# EAGLE design Circuit (EAGLE 9.6.2)
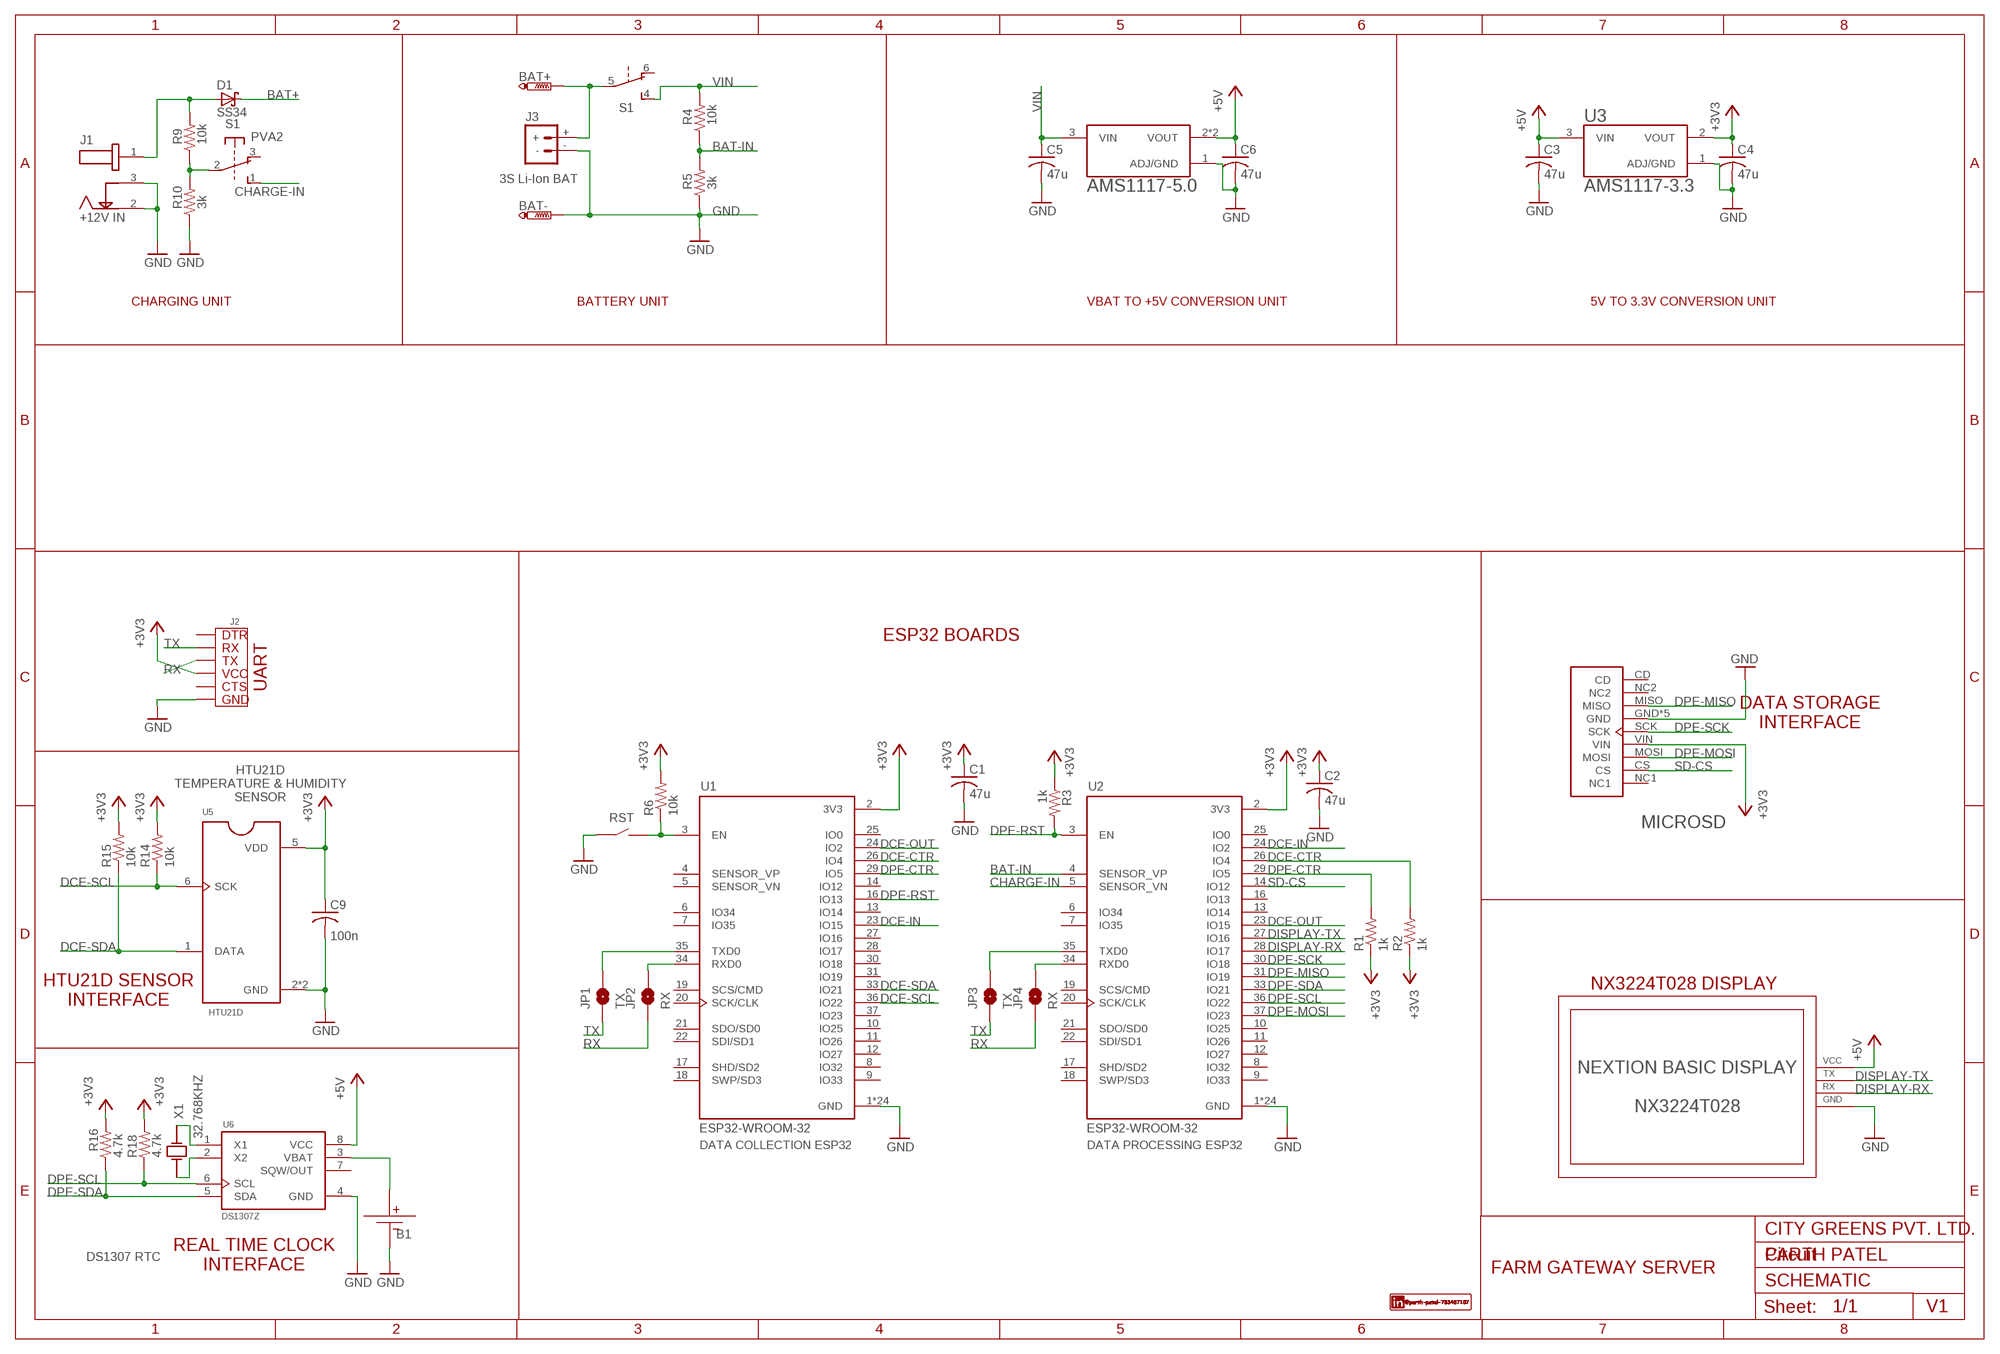
[diagram p0: schematic, sheet 1]

## Parts
B1  CR3032-METAL  [CR2032-METAL]
BAT+  PTR1TP20SQ  [TP20SQ]
BAT-  PTR1TP20SQ  [TP20SQ]
C1  47u  C-USC0805  [C0805]
C2  47u  C-USC0805  [C0805]
C3  47u  C-USC0805  [C0805]
C4  47u  C-USC0805  [C0805]
C5  47u  C-USC0805  [C0805]
C6  47u  C-USC0805  [C0805]
C9  100n  C-USC0805  [C0805]
D1  SS34  [DO214]
J1  +12V IN  DCJ200-10-A-XX-X_REVA  [GCT_DCJ200-10-A-XX-X_REVA]
J2  UART  [UART]
J3  3S Li-Ion BAT  BATTERY_CONN_DEANS  [DEANS]
JP1  TX  JUMPER-SMT_2_NO_NO-SILK  [SMT-JUMPER_2_NO_NO-SILK]
JP2  RX  JUMPER-SMT_2_NO_NO-SILK  [SMT-JUMPER_2_NO_NO-SILK]
JP3  TX  JUMPER-SMT_2_NO_NO-SILK  [SMT-JUMPER_2_NO_NO-SILK]
JP4  RX  JUMPER-SMT_2_NO_NO-SILK  [SMT-JUMPER_2_NO_NO-SILK]
MICROSD  ST-TF-003A  [SUNTECH_ST-TF-003A]
NX3224T028  NX3224T028_011  [NX3224T028_011]
R1  1k  R-US_R0805  [R0805]
R2  1k  R-US_R0805  [R0805]
R3  1k  R-US_R0805  [R0805]
R4  10k  R-US_R0805  [R0805]
R5  3k  R-US_R0805  [R0805]
R6  10k  R-US_R0805  [R0805]
R9  10k  R-US_R0805  [R0805]
R10  3k  R-US_R0805  [R0805]
R14  10k  R-US_R0805  [R0805]
R15  10k  R-US_R0805  [R0805]
R16  4.7k  R-US_R0805  [R0805]
R18  4.7k  R-US_R0805  [R0805]
RST  4.5X4.5-SMD-TACTILE-SWITCH  [SMD-4.5X4.5-TACTILE-PUSH-BUTTON]
S1  PVA2  [PVA2F]
U1  ESP32-WROOM-32  [MODULE_ESP32-WROOM-32]
U2  ESP32-WROOM-32  [MODULE_ESP32-WROOM-32]
U3  AMS1117-3.3  [SOT229P700X180-4N]
U4  AMS1117-5.0  [SOT229P700X180-4N]
U5  HTU21D  [QFN100P300X300X100-7N]
U6  DS1307Z  [SOIC127P600X175-8N]
X1  32.768KHZ  AB38T-32.768KHZ  [XTAL_AB38T-32.768KHZ]

## Nets
+3V3: C1.1 C2.1 C4.1 C9.1 J2.VCC MICROSD.VIN R1.1 R2.1 R3.1 R6.2 R14.2 R15.2 R16.2 R18.2 U1.2(3V3) U2.2(3V3) U3.2(VOUT) U5.5(VDD)
+5V: C3.1 C6.1 NX3224T028.VCC U3.3(VIN) U4.2(VOUT) U4.4(VOUT) U6.8(VCC)
BAT+: BAT+.TP D1.C J3.+ S1.5(2:P)
BAT-IN: R4.1 R5.2 U2.4(SENSOR_VP)
CHARGE-IN: S1.1(1:S) U2.5(SENSOR_VN)
CHARGE-V: R9.1 R10.2 S1.2(1:P)
DCE-CTR: R2.2 U1.26(IO4) U2.26(IO4)
DCE-IN: U1.23(IO15) U2.24(IO2)
DCE-OUT: U1.24(IO2) U2.23(IO15)
DCE-SCL: R14.1 U1.36(IO22) U5.6(SCK)
DCE-SDA: R15.1 U1.33(IO21) U5.1(DATA)
DISPLAY-RX: NX3224T028.RX U2.28(IO17)
DISPLAY-TX: NX3224T028.TX U2.27(IO16)
DPE-CTR: R1.2 U1.29(IO5) U2.29(IO5)
DPE-MISO: MICROSD.MISO U2.31(IO19)
DPE-MOSI: MICROSD.MOSI U2.37(IO23)
DPE-RST: R3.2 U1.16(IO13) U2.3(EN)
DPE-SCK: MICROSD.SCK U2.30(IO18)
DPE-SCL: R18.1 U2.36(IO22) U6.6(SCL)
DPE-SDA: R16.1 U2.33(IO21) U6.5(SDA)
GND: B1.-VE1(-VE) B1.-VE2(-VE) BAT-.TP C1.2 C2.2 C3.2 C4.2 C5.2 C6.2 C9.2 J1.2 J1.3 J2.GND J3.- MICROSD.GND MICROSD.GND2(GND) MICROSD.GND3(GND) MICROSD.GND4(GND) MICROSD.GND5(GND) NX3224T028.GND R5.1 R10.1 RST.1.1(S1) RST.1.2(S1) U1.1(GND) U1.15(GND) U1.38(GND) U1.39_1(GND) U1.39_2(GND) U1.39_3(GND) U1.39_4(GND) U1.39_5(GND) U1.39_6(GND) U1.39_7(GND) U1.39_8(GND) U1.39_9(GND) U1.39_10(GND) U1.39_11(GND) U1.39_12(GND) U1.39_13(GND) U1.39_14(GND) U1.39_15(GND) U1.39_16(GND) U1.39_17(GND) U1.39_18(GND) U1.39_19(GND) U1.39_20(GND) U1.39_21(GND) U2.1(GND) U2.15(GND) U2.38(GND) U2.39_1(GND) U2.39_2(GND) U2.39_3(GND) U2.39_4(GND) U2.39_5(GND) U2.39_6(GND) U2.39_7(GND) U2.39_8(GND) U2.39_9(GND) U2.39_10(GND) U2.39_11(GND) U2.39_12(GND) U2.39_13(GND) U2.39_14(GND) U2.39_15(GND) U2.39_16(GND) U2.39_17(GND) U2.39_18(GND) U2.39_19(GND) U2.39_20(GND) U2.39_21(GND) U3.1(ADJ/GND) U4.1(ADJ/GND) U5.2(GND) U5.PAD(GND) U6.4(GND)
N$1: R6.1 RST.2.1(S2) RST.2.2(S2) U1.3(EN)
N$2: JP4.2 U2.34(RXD0)
N$3: JP3.2 U2.35(TXD0)
N$4: B1.+VE U6.3(VBAT)
N$5: JP2.2 U1.34(RXD0)
N$6: D1.A J1.1 R9.2
N$7: JP1.2 U1.35(TXD0)
N$14: U6.2(X2) X1.1
N$16: U6.1(X1) X1.2
RX: J2.TX JP2.1 JP4.1
SD-CS: MICROSD.CS U2.14(IO12)
TX: J2.RX JP1.1 JP3.1
VIN: C5.1 R4.2 S1.4(2:S) U4.3(VIN)
Unconnected: J2.CTS J2.DTR MICROSD.CD MICROSD.NC1 MICROSD.NC2 S1.3(1:O) S1.6(2:O) U1.4(SENSOR_VP) U1.5(SENSOR_VN) U1.6(IO34) U1.7(IO35) U1.8(IO32) U1.9(IO33) U1.10(IO25) U1.11(IO26) U1.12(IO27) U1.13(IO14) U1.14(IO12) U1.17(SHD/SD2) U1.18(SWP/SD3) U1.19(SCS/CMD) U1.20(SCK/CLK) U1.21(SDO/SD0) U1.22(SDI/SD1) U1.25(IO0) U1.27(IO16) U1.28(IO17) U1.30(IO18) U1.31(IO19) U1.37(IO23) U2.6(IO34) U2.7(IO35) U2.8(IO32) U2.9(IO33) U2.10(IO25) U2.11(IO26) U2.12(IO27) U2.13(IO14) U2.16(IO13) U2.17(SHD/SD2) U2.18(SWP/SD3) U2.19(SCS/CMD) U2.20(SCK/CLK) U2.21(SDO/SD0) U2.22(SDI/SD1) U2.25(IO0) U6.7(SQW/OUT)

## Notes on the sheet
- CHARGING UNIT | BATTERY UNIT | VBAT TO +5V CONVERSION UNIT | 5V TO 3.3V CONVERSION UNIT
- ESP32 BOARDS
- DATA STORAGE
  INTERFACE
- HTU21D
  TEMPERATURE & HUMIDITY
  SENSOR
- HTU21D SENSOR
  INTERFACE
- NX3224T028 DISPLAY
- DATA COLLECTION ESP32 | DATA PROCESSING ESP32
- CITY GREENS PVT. LTD.
- REAL TIME CLOCK
  INTERFACE
- PARTH PATEL
- DS1307 RTC
- FARM GATEWAY SERVER
- SCHEMATIC
- V1

## Library data of the parts
B1 = Battery Holder:CR3032-METAL
BAT+ BAT- = testpad:PTR1: TEST PIN
C1-C6 C9 = rcl:C-US: CAPACITOR, American symbol; SPICEPREFIX: C
D1 = SS34:SS34: SS34 Schottky diode http://www.vishay.com/docs/88751/ss32.pdf Check availability <https://pricing.snapeda.com/parts/SS34/ON%20Semiconductor/view-part?ref=eda>; AVAILABILITY: In Stock; DESCRIPTION: Diode Schottky 40 V 3A Surface Mount SMC (DO-214AB); MF: ON Semiconductor; MP: SS34; PACKAGE: SMC-2 ON Semiconductor; PRICE: None; PURCHASE-URL: https://pricing.snapeda.com/search/part/SS34/?ref=eda
J1 = DC Jack:DCJ200-10-A-XX-X_REVA: DC Power Jack, Thru-Hole, Horizontal, with Locating Pegs, D2.0mm Check prices <https://pricing.snapeda.com/parts/DCJ200-10-A-K1-K/Global%20Connector%20Technology/view-part?ref=eda>; AVAILABILITY: Warning; DESCRIPTION: Power Barrel Connector Jack 2.05mm ID (0.081), 5.50mm OD (0.217) Through Hole, Right Angle; MF: Global Connector Technology; MP: DCJ200-10-A-K1-K; PACKAGE: None; PRICE: None; PURCHASE-URL: https://pricing.snapeda.com/search/part/DCJ200-10-A-K1-K/?ref=eda
J2 = FTDI Adapter:UART
J3 = SparkFun-Connectors:BATTERY_CONN: Battery Connectors Various footprints for battery connections SparkFun Products: Deans Connector -M/F Pair <https://www.sparkfun.com/products/11864>; SF_ID: PRT-11864
JP1-JP4 = SparkFun-Jumpers:JUMPER-SMT_2_NO: Normally open jumper This jumper has two pads in close proximity to each other. Apply solder to close the connection. Round pads are easier to solder for beginners, but are a lot larger. SparkFun Product that uses the round pads: SparkFun EL Sequencer <https://www.sparkfun.com/products/12781>
MICROSD = MicroSD Card Socket:ST-TF-003A: Micro SD Card Socket Check availability <https://pricing.snapeda.com/parts/ST-TF-003A/Suntech/view-part?ref=eda>; AVAILABILITY: Not in stock; DESCRIPTION: Micro SD Card Socket; MF: Suntech; MP: ST-TF-003A; PACKAGE: None; PRICE: None
NX3224T028 = Nextion Display:NX3224T028_011
R1-R6 R9 R10 R14-R16 R18 = rcl:R-US_: RESISTOR, American symbol; SPICEPREFIX: R
RST = Switches:4.5X4.5-SMD-TACTILE-SWITCH
S1 = switch-misc:PVA2: ITT SWITCH
U1 U2 = ESP32 WROOM 32:ESP32-WROOM-32: Bluetooth, WiFi Transceiver Module 2.4GHz ~ 2.5GHz Surface Mount Check availability <https://pricing.snapeda.com/parts/ESP32-WROOM-32/Espressif%20Systems/view-part?ref=eda>; AVAILABILITY: In Stock; DESCRIPTION: Bluetooth, WiFi 802.11b/g/n, Bluetooth v4.2 +EDR, Class 1, 2 and 3 Transceiver Module 2.4GHz ~ 2.5GHz Antenna Not Included, U.FL Surface Mount; MF: Espressif Systems; MP: ESP32-WROOM-32; PACKAGE: Module Espressif Systems; PRICE: None; PURCHASE-URL: https://pricing.snapeda.com/search/part/ESP32-WROOM-32/?ref=eda
U3 = AMS1117-3.3:AMS1117-3.3: Sot223/Pkg 1-Amp 3.3-Volt Low Drop Out Voltage Regulatator Check availability <https://pricing.snapeda.com/parts/AMS1117-3.3/AMD/view-part?ref=eda>; AVAILABILITY: Not in stock; DESCRIPTION: LDO Voltage Regulators 800MA LDO LINEAR REG; MF: AMD; MP: AMS1117-3.3; PACKAGE: None; PRICE: None
U4 = AMS1117-5.0:AMS1117-5.0: Sot223/Pkg 1-Amp 5-Volt Low Drop Out Voltage Regulatator Check availability <https://pricing.snapeda.com/parts/AMS1117-5.0/Advanced%20Monolithic%20Systems/view-part?ref=eda>; AVAILABILITY: Not in stock; DESCRIPTION: Sot223/Pkg 1-Amp 5-Volt Low Drop Out Voltage Regulatator; MF: Advanced Monolithic Systems; MP: AMS1117-5.0; PACKAGE: SOT-223 Seeed Technology; PRICE: None
U5 = HTU21D:HTU21D: Digital Relative Humidity sensor with Temperature output Check availability <https://pricing.snapeda.com/parts/HTU21D/TE%20Connectivity/view-part?ref=eda>; AVAILABILITY: In Stock; COMMENT: CAT-HSC0004; DESCRIPTION: HTU21D Humidity, Temperature Sensor Xplained Pro Platform Evaluation Expansion Board; MF: TE Connectivity; MP: HTU21D; PACKAGE: DFN-6 TE Connectivity; PRICE: None; PURCHASE-URL: https://pricing.snapeda.com/search/part/HTU21D/?ref=eda
U6 = DS1307Z:DS1307Z: Real Time Clock Serial 56Byte 8-Pin SOIC N Check availability <https://pricing.snapeda.com/parts/DS1307Z/Maxim%20Integrated/view-part?ref=eda>; AVAILABILITY: In Stock; DESCRIPTION: Real Time Clock (RTC) IC Clock/Calendar 56B I²C, 2-Wire Serial 8-SOIC (0.154, 3.90mm Width); MF: Maxim Integrated; MP: DS1307Z; PACKAGE: SOIC-8 Maxim; PRICE: None; PURCHASE-URL: https://pricing.snapeda.com/search/part/DS1307Z/?ref=eda
X1 = 32.768KHZ:AB38T-32.768KHZ: AB38T Series 32.768 kHz ±20 ppm 12.5 pF -10 to +60 °C Tuning Fork Crystal Check availability <https://pricing.snapeda.com/parts/AB38T-32.768KHZ/Abracon/view-part?ref=eda>; AVAILABILITY: In Stock; DESCRIPTION: 32.768 kHz ±20ppm Crystal 12.5pF 30 kOhms Cylindrical Can, Radial; MF: Abracon; MP: AB38T-32.768KHZ; PACKAGE: Cylindrical Can Radial Abracon; PRICE: None; PURCHASE-URL: https://pricing.snapeda.com/search/part/AB38T-32.768KHZ/?ref=eda

## Board
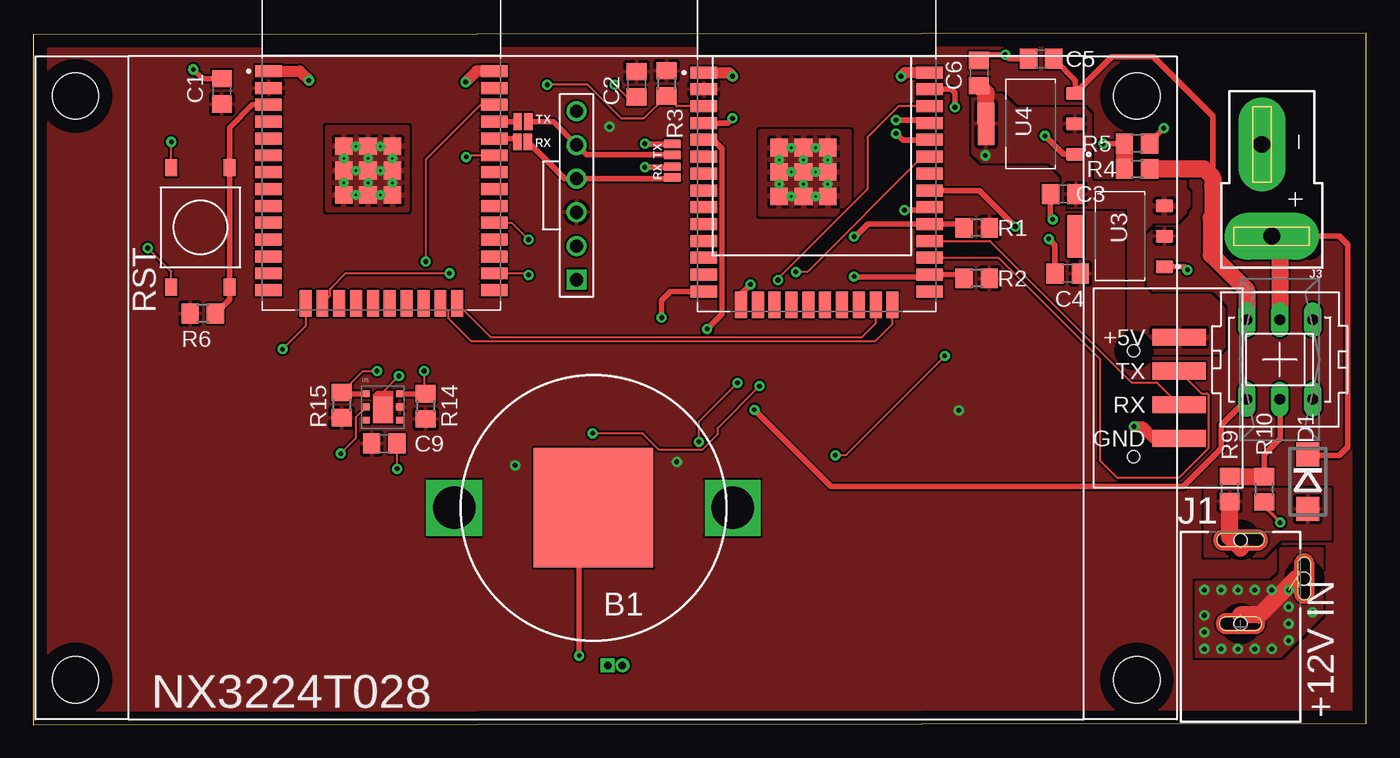
[diagram p1: board, top side]
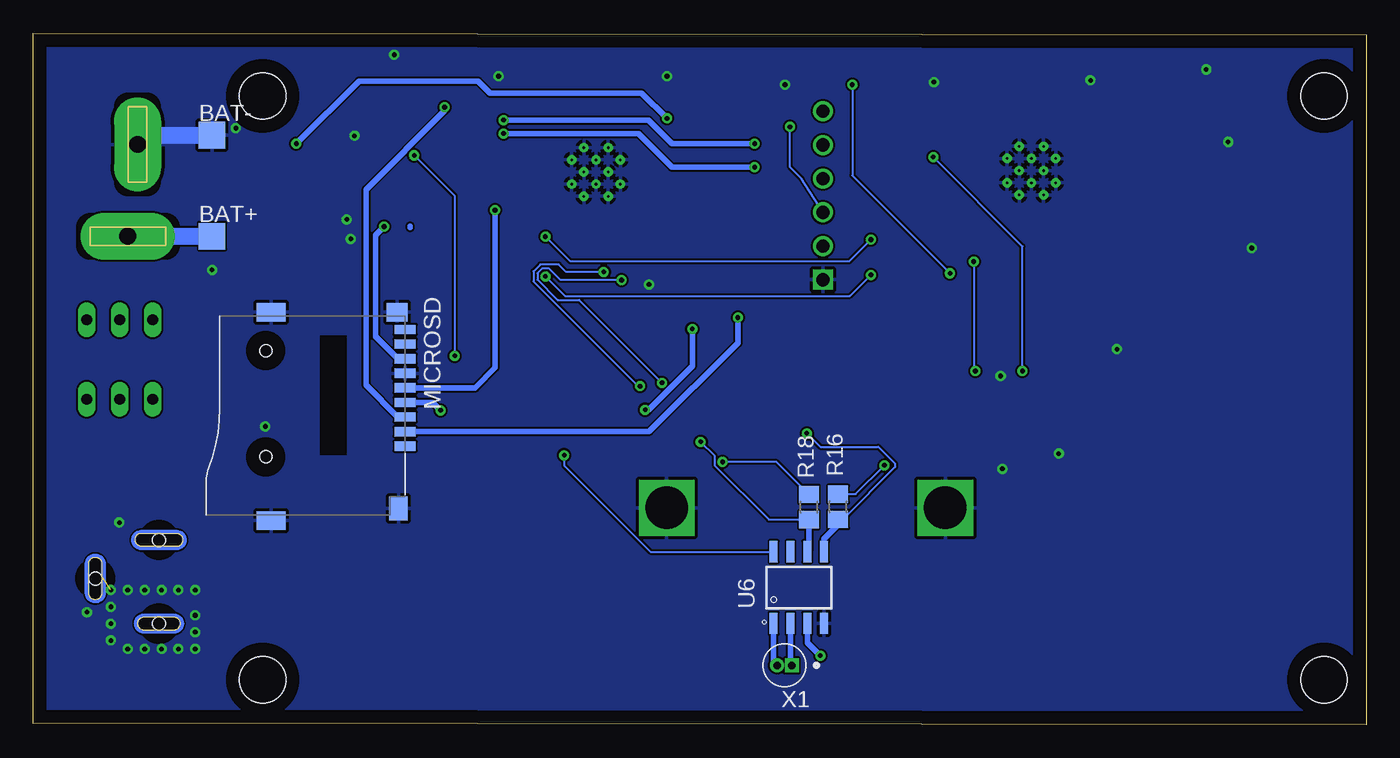
[diagram p2: board, bottom side, seen from below]

Size 100.47 x 52.14 mm. Coordinates in mm from the lower left corner, seen from the top.
Outline: 0,0 100.47,0.1 100.47,52.14 0,52.04 0,0
Copper layers (1*16): Top 0.035mm / dielectric 1.5mm / Bottom 0.035mm
Design rules "default *": minimum track width 6mil, minimum drill 0.35mm, track to track 6mil, track to pad 6mil, pad to pad 6mil, via to via 6mil, smd to smd 6mil, copper to edge 40mil, drill to drill 6mil, minimum pad ring 10mil, minimum via ring 8mil, stop-mask expansion 4mil, vias tented up to drill 15mil, thermal gap 10mil

### Footprints (pad centres in the part's own frame; a part is rotated, then mirrored left to right if it is on the bottom)
CR2032-METAL = smd 9 x 9: +VE 0,0 | drill 3.2 square: -VE1 -10.5,0; -VE2 10.5,0
TP20SQ = smd 2 x 2: TP 0,0
C0805 = smd 1.3 x 1.5: 1 -0.95,0; 2 0.95,0
DO214 = smd 1.8 x 1.7: A 2.05,0; C -2.05,0
GCT_DCJ200-10-A-XX-X_REVA = smd 0.1 x 0.1: 1 0,5.95; 2 0,0.9; 3 4.2,3.65 | hole 1: 0,0.25; 4.8,3.65; 0,6.55
UART = drill 1: CTS 3.81,0; DTR -6.35,0; RX -3.81,0; TX -1.27,0; VCC 1.27,0 | drill 1 square: GND 6.35,0
DEANS = drill 1.27 pad 3.556 long: + 0,0; - 0.737,-6.921
SMT-JUMPER_2_NO_NO-SILK = smd 0.635 x 1.27: 1 -0.406,0; 2 0.406,0
SUNTECH_ST-TF-003A = smd 0.7 x 1.6: CD -5.28,5.33; CS 2.42,5.33; GND5 -1.98,5.33; MISO -3.08,5.33; MOSI 1.32,5.33; NC1 3.52,5.33; NC2 -4.18,5.33; SCK -0.88,5.33; VIN 0.22,5.33 | smd 1.4 x 1.6: GND -6.58,4.73 | smd 1.8 x 1.4: GND2 8.22,4.83 | smd 1.4 x 2.2: GND3 9.12,-4.77; GND4 -6.58,-4.77 | hole 0.9: -3.68,-5.17; 4.32,-5.17
NX3224T028_011 = smd 4 x 1.27: GND 43.18,-3.81; RX 43.18,-1.27; TX 43.18,1.27; VCC 43.18,3.81 | hole 3.5: -40,22; -40,-22; 40,22; 40,-22
R0805 = smd 1.3 x 1.5: 1 -0.95,0; 2 0.95,0
SMD-4.5X4.5-TACTILE-PUSH-BUTTON = smd 1.27 x 0.9: 1.1 -4.5,2.2; 1.2 4.5,2.2; 2.1 -4.5,-2.2; 2.2 4.5,-2.2
PVA2F = drill 0.813 long: 1 -2.997,2.489; 2 -2.997,0; 3 -2.997,-2.489; 4 2.997,2.489; 5 2.997,0; 6 2.997,-2.489
MODULE_ESP32-WROOM-32 = smd 2 x 0.9: 1 -8.5,5.26; 2 -8.5,3.99; 3 -8.5,2.72; 4 -8.5,1.45; 5 -8.5,0.18; 6 -8.5,-1.09; 7 -8.5,-2.36; 8 -8.5,-3.63; 9 -8.5,-4.9; 10 -8.5,-6.17; 11 -8.5,-7.44; 12 -8.5,-8.71; 13 -8.5,-9.98; 14 -8.5,-11.25; 25 8.5,-11.25; 26 8.5,-9.98; 27 8.5,-8.71; 28 8.5,-7.44; 29 8.5,-6.17; 30 8.5,-4.9; 31 8.5,-3.63; 32 8.5,-2.36; 33 8.5,-1.09; 34 8.5,0.18; 35 8.5,1.45; 36 8.5,2.72; 37 8.5,3.99; 38 8.5,5.26 | smd 0.9 x 2: 15 -5.715,-12.25; 16 -4.445,-12.25; 17 -3.175,-12.25; 18 -1.905,-12.25; 19 -0.635,-12.25; 20 0.635,-12.25; 21 1.905,-12.25; 22 3.175,-12.25; 23 4.445,-12.25; 24 5.715,-12.25 | smd 1.33 x 1.33: 39_1 -2.835,-0.405; 39_2 -1,-0.405; 39_3 0.835,-0.405; 39_4 -2.835,-2.24; 39_5 -1,-2.24; 39_6 0.835,-2.24; 39_7 -2.835,-4.075; 39_8 -1,-4.075; 39_9 0.835,-4.075 | drill 0.2 pad 0.3: 39_10 -1.917,-0.405; 39_11 -0.083,-0.405; 39_12 -2.835,-1.323; 39_13 -1,-1.323; 39_14 0.835,-1.323; 39_15 -1.917,-2.24; 39_16 -0.083,-2.24; 39_17 -2.835,-3.158; 39_18 -1,-3.158; 39_19 0.835,-3.158; 39_20 -1.917,-4.075; 39_21 -0.083,-4.075
SOT229P700X180-4N = smd 0.93 x 1.31: 1 -2.29,-3.345; 2 0,-3.345; 3 2.29,-3.345 | smd 3.24 x 1.31: 4 0,3.345
QFN100P300X300X100-7N = smd 0.5 x 0.5: 1 -1.25,1; 2 -1.25,0; 3 -1.25,-1; 4 1.25,-1; 5 1.25,0; 6 1.25,1 | smd 1.5 x 2: PAD 0,-0.2
SOIC127P600X175-8N = smd 1.6 x 0.6: 1 -2.7,1.905; 2 -2.7,0.635; 3 -2.7,-0.635; 4 -2.7,-1.905; 5 2.7,-1.905; 6 2.7,-0.635; 7 2.7,0.635; 8 2.7,1.905
XTAL_AB38T-32.768KHZ = drill 0.55 pad 0.7 square: 1 -0.55,0 | drill 0.55 pad 0.7: 2 0.55,0

### Placement (x,y rotation side)
B1  42.22,16.36 180 top
BAT+  86.99,36.83 0 bottom
BAT-  86.99,44.45 0 bottom
C1  14.22,47.75 90 top
C2  45.48,48.29 270 top
C3  77.63,40.02 180 top
C4  77.96,34.02 180 top
C5  75.96,50.2 180 top
C6  71.28,49.13 90 top
C9  26.45,21.2 0 top
D1  96.06,18.32 270 top
J1  90.99,7.38 0 top
J2  40.95,39.9 270 top
J3  93.34,36.83 180 top
JP1  36.91,45.46 180 top
JP2  36.88,43.94 180 top
JP3  48.16,43.38 90 top
JP4  48.16,41.67 90 top
MICROSD  77.77,24.52 270 bottom
NX3224T028  43.18,25.4 0 top
R1  71.12,37.46 180 top
R2  71.12,33.65 180 top
R3  47.72,48.35 270 top
R4  83.18,41.91 0 top
R5  83.18,43.81 180 top
R6  12.79,31 180 top
R9  90.17,17.78 270 top
R10  92.77,17.75 90 top
R14  29.58,24 270 top
R15  23.25,24.1 270 top
R16  39.81,16.44 90 bottom
R18  42.01,16.42 90 bottom
RST  12.61,37.5 90 top
S1  93.95,27.54 90 top
U1  26.24,44.02 0 top
U2  59.05,43.91 0 top
U3  81.91,36.83 90 top
U4  75.16,45.3 90 top
U5  26.37,23.96 0 top
U6  42.77,10.34 90 bottom
X1  43.85,4.48 180 bottom

### Tracks (layer width: path | path; a pad name or v marks a point on that pad's centre or on a via)
+3V3  (via drill 0.35)
  Bottom 0.152: R18.2 44.45,19.81 v48.51,19.81 | R16.2 38.49,17.39 v36.32,19.56 | J2.VCC 42.57,41.17 43.43,42.04 v43.43,45.09
  Bottom 0.406: MICROSD.VIN 70.36,24.3 v69.77,23.7 | 72.07,37.59 R1.1 72.06,37.6 72.07,37.59
  pour Top (rank 6): -1.91,52.07 -1.91,-1.27 99.69,-1.27 99.69,52.07
+5V  (via drill 0.35)
  Top 0.152: v68.71,27.81 61.21,20.32 v60.45,20.32
  Top 1.27: U4.4 71.82,47.64 C6.1
  Bottom 0.152: v71.75,42.93 68.71,39.88 v68.71,27.81 | v60.45,20.32 60.45,19.55 53.95,13.04 U6.8
  pour Top: 70.77,47.5 70.77,43.1 71.46,42.4 76.56,42.4 77.56,41.4 77.56,39.4 77.96,39 82.66,39 83.46,38.2 86.27,38.2 87.16,39.1 87.16,40.1 86.36,40.9 79.86,40.9 79.77,41 79.77,46 79.27,46.5 74.06,46.5 73.06,47.5
  pour Top: 83.36,28.1 89.27,28.1 89.66,28.5 89.66,31.3 88.66,32.3 84.16,32.3 83.56,32.9 83.56,37.2 84.36,38 86.06,38 86.77,38.7 86.77,40.9 82.86,40.9 82.66,40.7 82.66,28.8
BAT+
  Top 0.406: J3.+ 98.42,36.83 99.06,36.2 99.06,20.96 98.42,20.32 96.11,20.32 D1.C
  Top 1.27: J3.+ 93.95,36.22 S1.5
  Bottom 1.27: J3.+ BAT+.TP
BAT-IN  (via drill 0.35)
  Top 0.406: U2.4 52.35,45.36 v52.71,45.72 | v80.64,43.81 R5.2
  Top 1.27: R5.2 R4.1
  Bottom 0.406: v52.71,45.72 54.61,47.62 66.04,47.62 66.95,48.53 75.93,48.53 v80.64,43.81
CHARGE-IN  (via drill 0.35)
  Top 0.406: S1.1 89.53,22.61 89.53,20.84 86.67,17.97 60.13,17.97 v54.36,23.75 | U2.5 51.24,44.09 51.91,43.42 51.91,30.96 v50.8,29.85
  Bottom 0.406: v50.8,29.85 50.8,27.03 54.08,23.75 v54.36,23.75
CHARGE-V
  Top 0.406: R10.2 92.77,20.39 93.98,21.59 93.98,24.51 S1.2
  Top 1.27: R9.1 92.74,18.73 R10.2
DCE-CTR  (via drill 0.35)
  Top 0.152: U1.26 37.21,34.03 v37.34,33.91
  Top 0.406: R2.2 69.89,33.93 U2.26 67.35,33.73 61.93,33.73 v61.87,33.8
  Bottom 0.152: v37.34,33.91 38.92,32.33 60.39,32.33 v61.87,33.8
DCE-IN
  Top 0.152: U1.23 31.28,31.17 31.28,30.67 33.02,28.93 63.48,28.93 64.77,30.23 64.77,31.5
  Top 0.406: 64.77,31.5 U2.24
DCE-OUT
  Top 0.152: U1.24 34.48,29.24 62.47,29.24 63.5,30.27 U2.23
DCE-SCL  (via drill 0.35)
  Top 0.152: U1.36 34.7,46.78 33.78,46.78 29.59,42.59 v29.59,34.92 | v29.46,26.67 29.46,25.07 R14.1
  Top 0.406: U5.6 R14.1
  Bottom 0.152: v29.59,34.92 29.59,26.8 v29.46,26.67
DCE-SDA  (via drill 0.35)
  Top 0.152: R15.1 24.88,26.67 v25.91,26.67 | v32.64,42.8 32.77,42.92 U1.33
  Top 0.406: U5.1 23.34,24.96 R15.1
  Bottom 0.152: v25.91,26.67 25.91,36.07 v32.64,42.8
DISPLAY-RX
  Top 0.152: NX3224T028.RX 84.68,25.81 82.77,25.81 72.1,36.47 U2.28
DISPLAY-TX
  Top 0.152: U2.27 72.74,35.2 80.39,27.56 80.39,19.94 81.67,18.66 86.39,18.66 88.59,20.86 88.59,24.86 88.45,24.99 88.04,24.99 NX3224T028.TX
DPE-CTR  (via drill 0.35)
  Top 0.152: U1.29 36.07,37.84 v37.34,36.58
  Top 0.406: R1.2 69.89,37.74 U2.29 62.91,37.74 61.97,36.8 v61.87,36.8
  Bottom 0.152: v37.34,36.58 38.99,34.93 59.99,34.93 v61.87,36.8
DPE-MISO  (via drill 0.35)
  Top 0.406: U2.31 71.3,40.28 v74.03,37.56
  Bottom 0.406: v74.03,37.56 74.66,36.92 74.66,29.27 72.99,27.6 MICROSD.MISO
DPE-MOSI  (via drill 0.35)
  Top 0.406: U2.37 69.21,47.9 69.46,47.65 v69.46,46.55
  Bottom 0.406: v69.46,46.55 69.46,46.29 75.4,40.36 75.4,25.61 72.99,23.2 MICROSD.MOSI
DPE-RST  (via drill 0.35)
  Top 0.152: U1.16 22.39,32.36 22.39,32.86 23.57,34.04 v31.37,34.04 | v38.73,48.26 41.78,48.26 44.32,45.72 46.04,45.72 R3.2 48.49,46.63 U2.3
  Bottom 0.152: v38.73,48.26 38.73,41.4 v31.37,34.04
DPE-SCK  (via drill 0.35)
  Top 0.406: U2.30 67.34,38.8 v65.66,38.8
  Bottom 0.406: v65.66,38.8 65.66,26.92 67.19,25.4 MICROSD.SCK
DPE-SCL  (via drill 0.35)
  Top 0.152: v56.13,33.53 56.13,33.65 62.87,40.39 62.87,44.29 65.21,46.63 U2.36 | v50.16,21.34 50.16,22.86 v53.09,25.78
  Bottom 0.152: v53.09,25.78 59.33,32.02 60.95,32.02 62.47,33.55 62.47,34.05 62.12,34.41 61.61,34.41 60.73,33.53 v56.13,33.53 | v50.16,21.34 49.12,20.29 49.12,19.56 45.03,15.47 R18.1
  Bottom 0.406: R18.1 42.01,13.17 U6.6
DPE-SDA  (via drill 0.35)
  Top 0.152: U2.33 67.51,42.87 67.07,42.87 58.34,34.13 v57.47,34.13 | v54.74,25.53 51.56,22.35 51.56,21.88 50.42,20.73 47.17,20.73 45.93,21.97 v42.16,21.97
  Bottom 0.152: v57.47,34.13 60.3,34.13 60.87,34.71 62.24,34.71 62.78,34.18 62.78,33.42 54.88,25.53 v54.74,25.53 | v42.16,21.97 41.15,20.96 36.78,20.96 35.51,19.68 35.51,19.43 39.45,15.49 R16.1
  Bottom 0.406: R16.1 39.81,15.05 40.86,14 U6.5
GND  (via drill 0.35)  (1 unrouted)
  Top 0.152: C2.2 44.73,47.34 v43.82,48.26 | U1.15 20.53,30.05 v18.8,28.32 | RST.1.2 v10.41,43.93 v10.41,43.94 | RST.1.1 10.41,34.17 v8.64,35.94 | C9.2 27.4,19.34 v27.43,19.3 | U5.PAD 26.37,25.1 v27.56,26.29 | U5.2 24.32,23.15 24.32,21.59 v23.18,20.45
  Top 0.254: R10.1 92.77,16.45 v93.98,15.24
  Top 0.406: U2.15 53.34,32.47 v54.07,33.2 | C3.2 76.68,38.25 v76.83,38.1 | v76.53,36.62 77.02,36.14 C4.2 | U3.1 86.74,34.54 v86.99,34.29 | R5.1 84.13,43.91 v85.2,44.97 | C1.2 12.77,48.7 v12.07,49.4 | U4.1 77.66,43.01 v76.27,44.4 | C6.2 71.72,50.52 v73.27,50.52 73.58,50.2 C5.2
  Top 0.813: U1.38 33.41,49.27 v32.59,48.46 | U2.38 65.68,49.17 v65.41,48.89 | U2.1 52.43,49.17 v52.71,48.89 | U1.1 20.09,49.27 v20.78,48.59 | v82.98,22.48 83.58,22.48 84.47,21.59 NX3224T028.GND
  Top 1.27: J1.3 92.44,8.28 J1.2
  Bottom 1.27: J3.- 91.91,44.45 BAT-.TP
  other vias: 94.61,6.35 94.61,7.62 94.61,8.89 96.42,8.49 94.61,10.16 93.34,10.16 92.07,10.16 90.8,10.16 89.53,10.16 88.27,10.16 88.27,8.25 88.27,6.99 88.27,5.71 89.53,5.71 90.8,5.71 92.07,5.71 93.34,5.71
  pour Bottom (rank 6): -3.17,53.34 -3.17,-2.54 100.96,-2.54 100.96,53.34
  pour Top: 22.18,45.03 22.18,38.85 28.17,38.85 28.17,45.03
  pour Top: 54.87,44.7 54.87,38.5 61.47,38.5 61.47,44.7
  pour Top (rank 5): 87.63,10.79 93.34,10.79 93.98,11.43 93.98,13.33 97.16,13.33 97.16,8.25 93.98,5.08 87.63,5.08
N$1
  Top 0.406: R6.1 14.81,32.06 RST.2.1 RST.2.2 14.81,45.03 16.51,46.73 U1.3
N$2  (via drill 0.35)
  Top 0.406: JP4.2 48.12,42.04 v46.1,42.04 | v65.02,44.58 65.53,44.07 67.53,44.07 U2.34
  Bottom 0.406: v46.1,42.04 52.32,42.04 54.86,44.58 v65.02,44.58
N$3  (via drill 0.35)
  Top 0.406: JP3.2 46.13,43.79 v46.1,43.81 | v65.02,45.59 67.33,45.59 U2.35
  Bottom 0.406: v46.1,43.81 52.32,43.81 54.1,45.59 v65.02,45.59
N$4  (via drill 0.35)
  Top 0.406: v41.15,5.21 41.15,15.28 B1.+VE
  Bottom 0.406: U6.3 42.13,6.19 v41.15,5.21
N$5
  Top 0.406: U1.34 36.22,44.2 JP2.2
N$6
  Top 1.27: J1.1 90.17,14.15 R9.2
  pour Top: 88.27,17.78 88.27,12.7 92.71,12.7 93.98,13.97 97.79,13.97 97.79,17.78
N$7
  Top 0.406: U1.35 JP1.2
N$14
  Bottom 0.406: U6.2 43.4,4.57 X1.1
N$16
  Bottom 0.406: U6.1 44.67,4.74 X1.2
RX
  Top 0.406: JP2.1 40.05,41.17 J2.TX 48.07,41.17 JP4.1
SD-CS  (via drill 0.35)
  Top 0.406: U2.14 48.03,32.66 47.37,32 v47.37,30.7
  Bottom 0.406: MICROSD.CS 54.05,22.1 47.37,28.79 v47.37,30.7
TX
  Top 0.406: JP1.1 39.2,45.46 J2.RX 41.69,42.97 JP3.1
VIN
  Top 0.406: 88.9,40.64 88.9,45.88 84.41,50.37 81.29,50.37 78.54,47.62 | U4.3 78.54,47.62 | C5.1 78.54,48.57 78.54,47.62
  Top 1.27: R4.2 88.27,41.91 88.9,41.27 88.9,40.64 88.9,38.34 88.79,38.23 88.79,35.43 91.46,32.76 S1.4